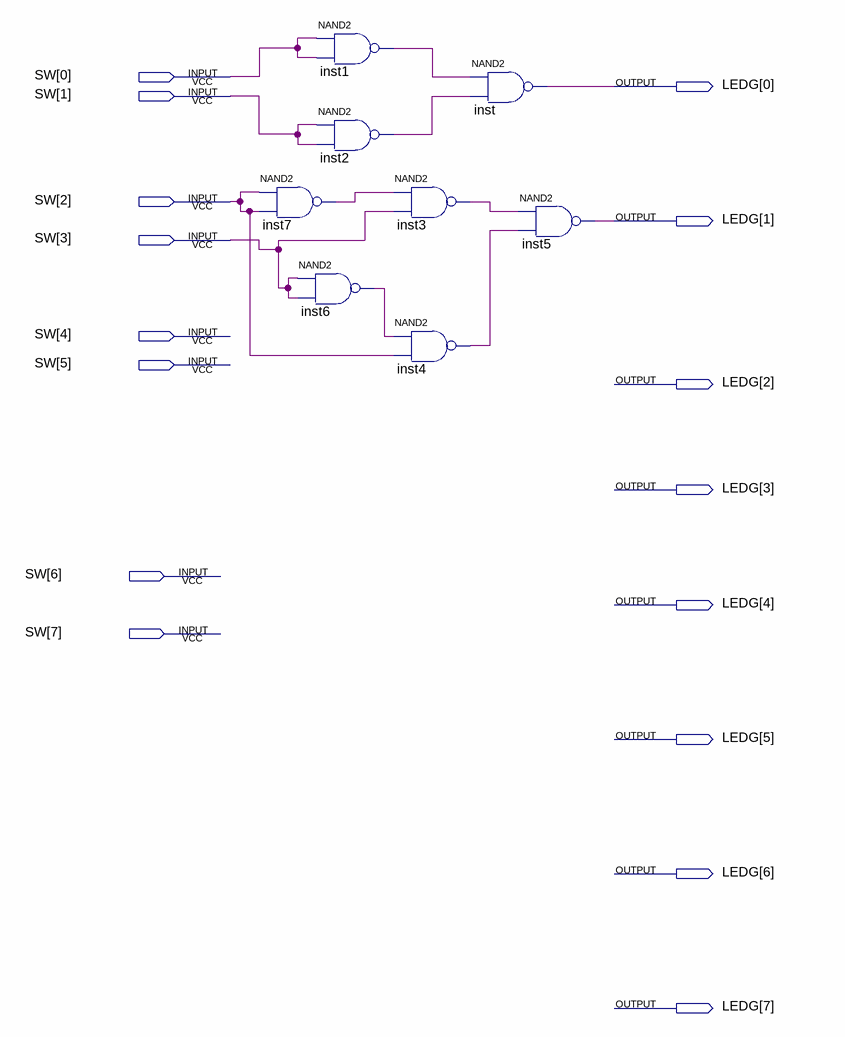
[diagram p0: schematic sheet]
// Quartus schematic LEDtest.bdf as structural Verilog: 8 symbols, 16 pins
module LEDtest (
  input  [7:0] SW,
  output [7:0] LEDG
);

  wire inst1_out, inst2_out, inst3_out, inst4_out, inst6_out, inst7_out;

  nand inst1 (inst1_out, SW[0], SW[0]);
  nand inst2 (inst2_out, SW[1], SW[1]);
  nand inst7 (inst7_out, SW[2], SW[2]);
  nand inst6 (inst6_out, SW[3], SW[3]);
  nand inst3 (inst3_out, inst7_out, SW[3]);
  nand inst4 (inst4_out, inst6_out, SW[2]);
  nand inst (LEDG[0], inst1_out, inst2_out);
  nand inst5 (LEDG[1], inst3_out, inst4_out);
endmodule
